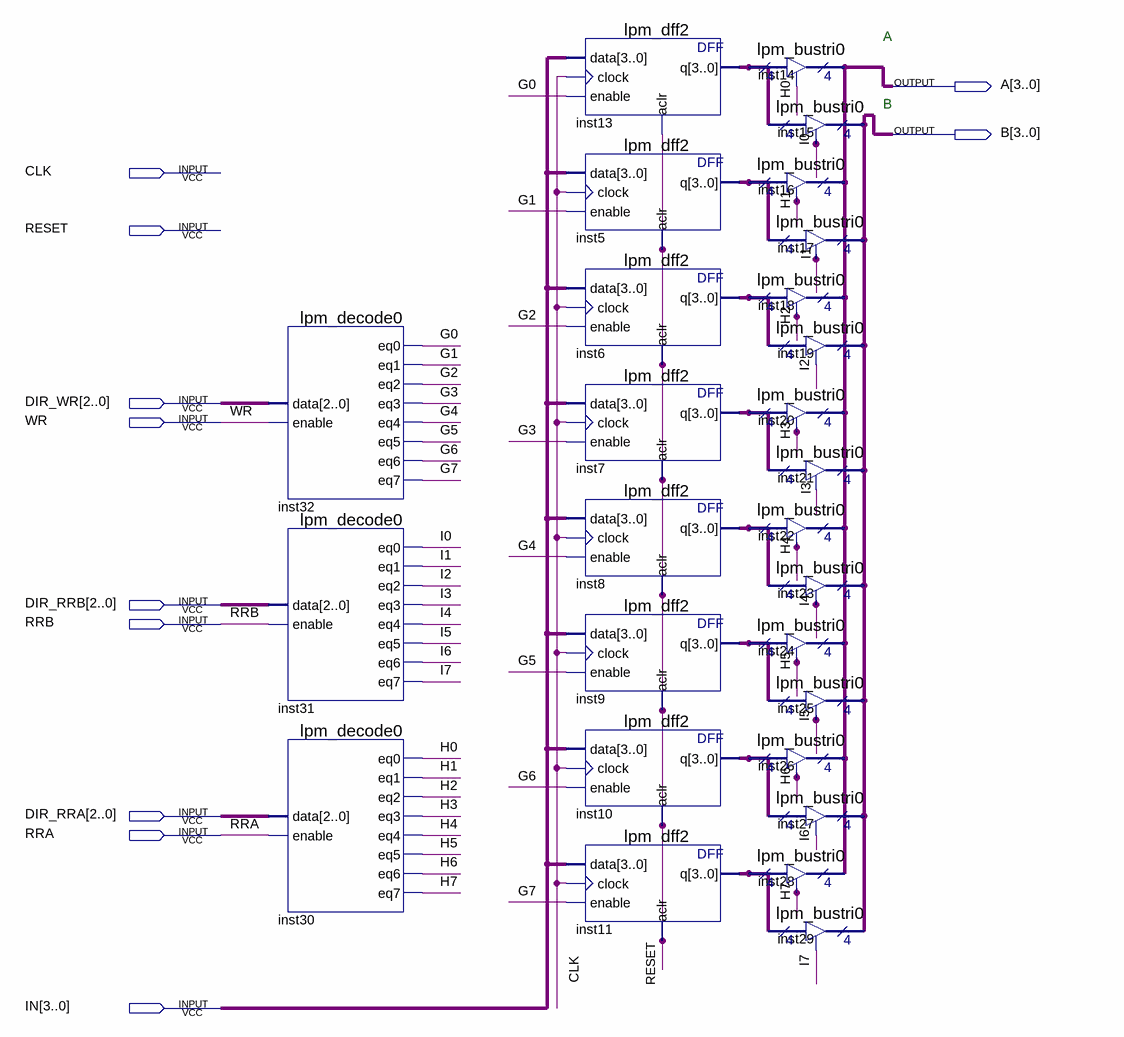
[diagram p0: schematic sheet]
// Quartus schematic BANK.bdf as structural Verilog: 27 symbols, 11 pins
module BANK (
  input  CLK,
  input  RESET,
  input  [2:0] DIR_WR,
  input  WR,
  input  [2:0] DIR_RRB,
  input  RRB,
  input  [2:0] DIR_RRA,
  input  RRA,
  input  [3:0] IN,
  output [3:0] A,
  output [3:0] B
);

  wire G0, G1, G2, G3, G4, G5, G6, G7, H0, H1, H2, H3, H4, H5, H6, H7, I0, I1, I2, I3, I4, I5, I6, I7;
  wire [3:0] inst5_q, inst6_q, inst7_q, inst8_q, inst9_q, inst10_q, inst11_q, inst13_q;

  lpm_decode0 inst32 (
    .data(DIR_WR), .enable(WR), .eq0(G0), .eq1(G1), .eq2(G2), .eq3(G3), .eq4(G4), .eq5(G5), .eq6(G6), .eq7(G7));
  lpm_decode0 inst31 (
    .data(DIR_RRB), .enable(RRB), .eq0(I0), .eq1(I1), .eq2(I2), .eq3(I3), .eq4(I4), .eq5(I5), .eq6(I6),
    .eq7(I7));
  lpm_decode0 inst30 (
    .data(DIR_RRA), .enable(RRA), .eq0(H0), .eq1(H1), .eq2(H2), .eq3(H3), .eq4(H4), .eq5(H5), .eq6(H6),
    .eq7(H7));
  lpm_dff2 inst13 (.data(IN), .clock(CLK), .enable(G0), .aclr(RESET), .q(inst13_q));
  lpm_dff2 inst5 (.data(IN), .clock(CLK), .enable(G1), .aclr(RESET), .q(inst5_q));
  lpm_dff2 inst6 (.data(IN), .clock(CLK), .enable(G2), .aclr(RESET), .q(inst6_q));
  lpm_dff2 inst7 (.data(IN), .clock(CLK), .enable(G3), .aclr(RESET), .q(inst7_q));
  lpm_dff2 inst8 (.data(IN), .clock(CLK), .enable(G4), .aclr(RESET), .q(inst8_q));
  lpm_dff2 inst9 (.data(IN), .clock(CLK), .enable(G5), .aclr(RESET), .q(inst9_q));
  lpm_dff2 inst10 (.data(IN), .clock(CLK), .enable(G6), .aclr(RESET), .q(inst10_q));
  lpm_dff2 inst11 (.data(IN), .clock(CLK), .enable(G7), .aclr(RESET), .q(inst11_q));
  lpm_bustri0 inst14 (.enabledt(H0), .data(inst13_q), .tridata(A));
  lpm_bustri0 inst15 (.enabledt(I0), .data(inst13_q), .tridata(B));
  lpm_bustri0 inst16 (.enabledt(H1), .data(inst5_q), .tridata(A));
  lpm_bustri0 inst17 (.enabledt(I1), .data(inst5_q), .tridata(B));
  lpm_bustri0 inst18 (.enabledt(H2), .data(inst6_q), .tridata(A));
  lpm_bustri0 inst19 (.enabledt(I2), .data(inst6_q), .tridata(B));
  lpm_bustri0 inst20 (.enabledt(H3), .data(inst7_q), .tridata(A));
  lpm_bustri0 inst21 (.enabledt(I3), .data(inst7_q), .tridata(B));
  lpm_bustri0 inst22 (.enabledt(H4), .data(inst8_q), .tridata(A));
  lpm_bustri0 inst23 (.enabledt(I4), .data(inst8_q), .tridata(B));
  lpm_bustri0 inst24 (.enabledt(H5), .data(inst9_q), .tridata(A));
  lpm_bustri0 inst25 (.enabledt(I5), .data(inst9_q), .tridata(B));
  lpm_bustri0 inst26 (.enabledt(H6), .data(inst10_q), .tridata(A));
  lpm_bustri0 inst27 (.enabledt(I6), .data(inst10_q), .tridata(B));
  lpm_bustri0 inst28 (.enabledt(H7), .data(inst11_q), .tridata(A));
  lpm_bustri0 inst29 (.enabledt(I7), .data(inst11_q), .tridata(B));

  // Notes on the sheet:
  //   A
  //   B
endmodule
